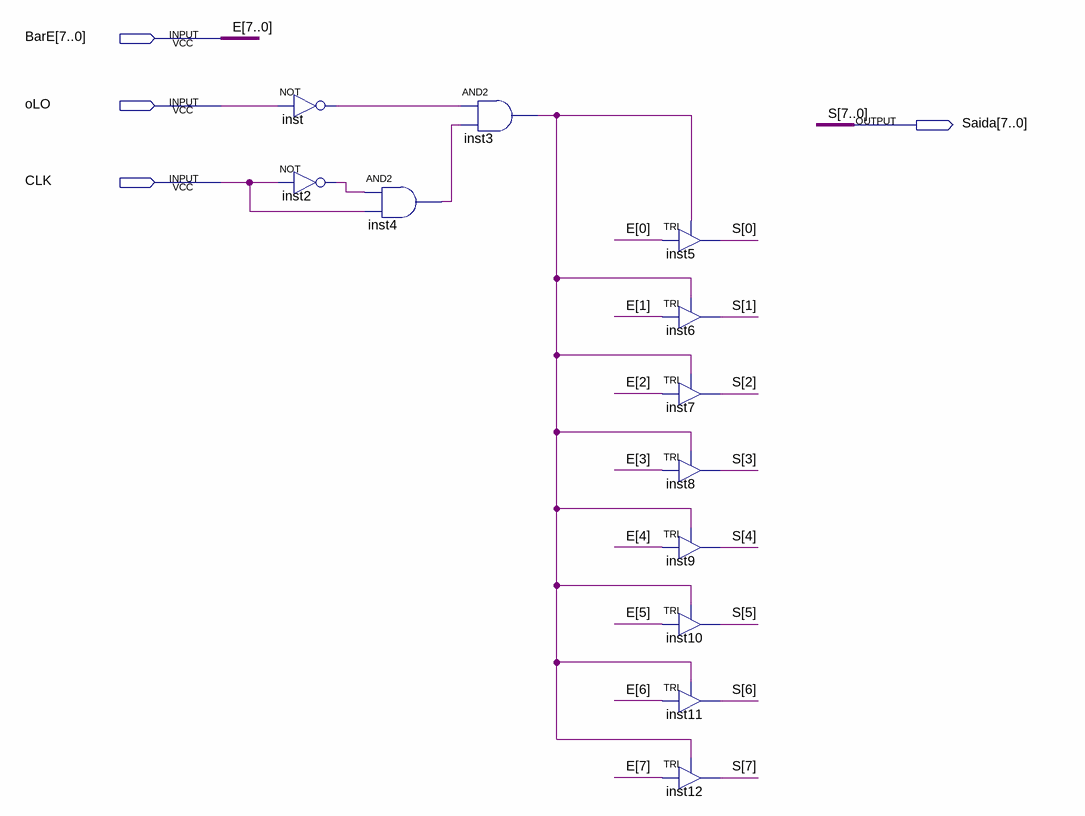
[diagram p0: schematic sheet]
// Quartus schematic Registrador_de_Saida.bdf as structural Verilog: 12 symbols, 4 pins
module Registrador_de_Saida (
  input  [7:0] BarE,
  input  oLO,
  input  CLK,
  output [7:0] Saida
);

  wire inst2_out, inst3_out, inst4_out, inst_out;

  not inst (inst_out, oLO);
  not inst2 (inst2_out, CLK);
  and inst4 (inst4_out, inst2_out, CLK);
  and inst3 (inst3_out, inst_out, inst4_out);
  TRI inst5 (.IN(BarE[0]), .OE(inst3_out), .OUT(Saida[0]));
  TRI inst6 (.IN(BarE[1]), .OE(inst3_out), .OUT(Saida[1]));
  TRI inst7 (.IN(BarE[2]), .OE(inst3_out), .OUT(Saida[2]));
  TRI inst8 (.IN(BarE[3]), .OE(inst3_out), .OUT(Saida[3]));
  TRI inst9 (.IN(BarE[4]), .OE(inst3_out), .OUT(Saida[4]));
  TRI inst10 (.IN(BarE[5]), .OE(inst3_out), .OUT(Saida[5]));
  TRI inst11 (.IN(BarE[6]), .OE(inst3_out), .OUT(Saida[6]));
  TRI inst12 (.IN(BarE[7]), .OE(inst3_out), .OUT(Saida[7]));

  // Other names for the same wires on the sheet: E[7:0] = BarE; S[7:0] = Saida
endmodule
